# Altium schematic sheet Sheet2-sensor.SchDoc
size A4; SheetNumber: 3; SheetTotal: 4
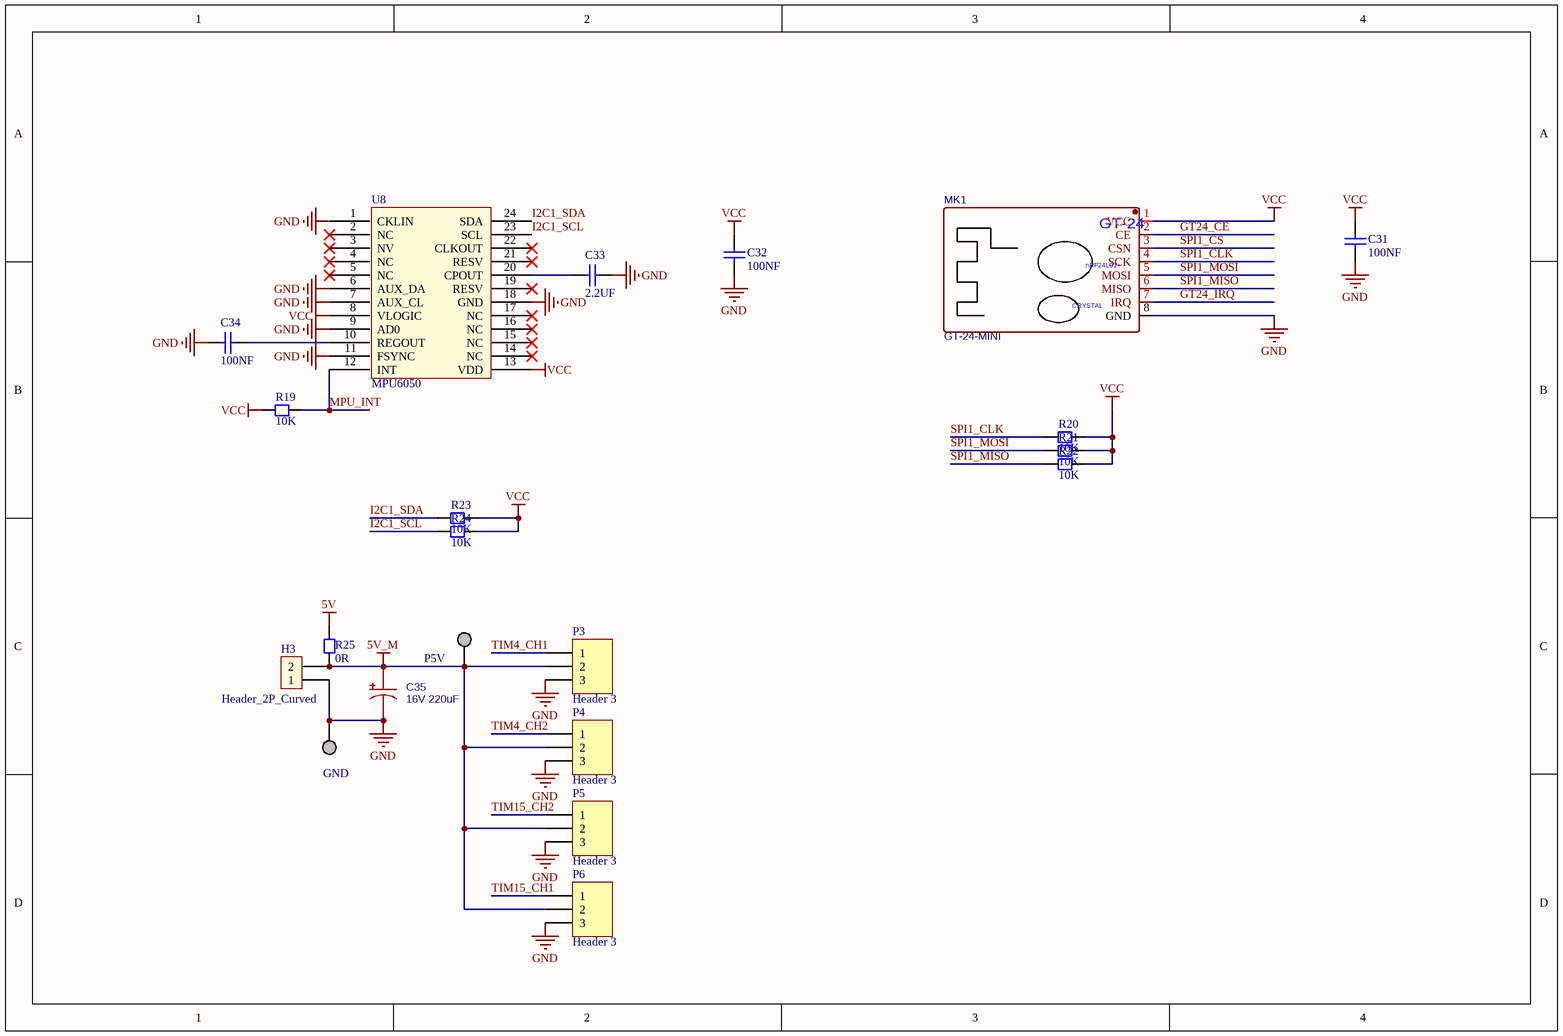
[diagram p0: Sheet2-sensor.SchDoc]

## Parts
C31  100NF  [CC1608-0603]
C32  100NF  [CC1608-0603]
C33  2.2UF  [CC1608-0603]
C34  100NF  [CC1608-0603]
C35  16V 220uF  [CAP-SMD_D6.3]
GND  test  [test]  (value not drawn)
H3  Header_2P_Curved  [Header_2_54_2PW]
MK1  GT-24-MINI  [GT24 _MINI]
P3  Header 3  [HDR1X3]
P4  Header 3  [HDR1X3]
P5  Header 3  [HDR1X3]
P5V  test  [test]  (value not drawn)
P6  Header 3  [HDR1X3]
R19  10K  [CR1608-0603]
R20  10K  [CR1608-0603]
R21  10K  [CR1608-0603]
R22  10K  [CR1608-0603]
R23  10K  [CR1608-0603]
R24  10K  [CR1608-0603]
R25  0R  [CR1608-0603]
U8  MPU6050  [QFN24 - duplicate]

## Nets
5V: R25.1
5V_M: C35.1 H3.2 P3.2 P4.2 P5.2 P5V.0 P6.2 R25.2
GND: C31.2 C32.2 C33.2 C34.1 C35.2 GND.0 H3.1 MK1.8(GND) P3.3 P4.3 P5.3 P6.3 U8.1(CKLIN) U8.6(AUX_DA) U8.7(AUX_CL) U8.9(AD0) U8.11(FSYNC) U8.18(GND)
VCC: C31.1 C32.1 MK1.1(VCC) R19.2 R20.1 R21.1 R22.1 R23.1 R24.1 U8.8(VLOGIC) U8.13(VDD)
GT24_CE: MK1.2(CE)
GT24_IRQ: MK1.7(IRQ)
I2C1_SCL: R24.2 U8.23(SCL)
I2C1_SDA: R23.2 U8.24(SDA)
MPU_INT: R19.1 U8.12(INT)
SPI1_CLK: MK1.4(SCK) R20.2
SPI1_CS: MK1.3(CSN)
SPI1_MISO: MK1.6(MISO) R22.2
SPI1_MOSI: MK1.5(MOSI) R21.2
TIM4_CH1: P3.1
TIM4_CH2: P4.1
TIM15_CH1: P6.1
TIM15_CH2: P5.1
NetC33_1: C33.1 U8.20(CPOUT)
NetC34_2: C34.2 U8.10(REGOUT)

Not connected (* = marked no-connect by the designer): U8 2(NC)* 3(NV)* 4(NC)* 5(NC)* 14(NC)* 15(NC)* 16(NC)* 17(NC)* 19(RESV)* 21(RESV)* 22(CLKOUT)*

## Notes on the sheet
- (in symbol GT-24-MINI) GT-24; nRF24L01+; CRYSTAL

## Library data of the parts
C31-C34 = Chip capacitor: 贴片电容
C35 = Cap ECAP SMD: 铝点解电容; BOM_Manufacturer: PANASONIC; BOM_Manufacturer Part: EEEFP1C681AP; nameAlias: Capacitance; Contributor: LCSC; BOM_Supplier: LCSC; BOM_Supplier Part: C413527; spicePre: C; spiceSymbolName: EEEFP1C681AP
GND P5V = test: 测试点
H3 = Header_2P_Curved: 弯的2P排针
MK1 = GT-24-MINI: 工业级GT-24数传无线模块 2.4G NRF24L01&PA+LNA; Manufacturer: Ashining(泽耀科技); Manufacturer Part: AS01-ML01S; Supplier: LCSC; Supplier Part: C84802; JLCPCB Part Class: Extended Part; spicePre: M; spiceSymbolName: AS01-ML01S
P3-P6 = Header 3: Header, 3-Pin; LatestRevisionDate: 17-Jul-2002; LatestRevisionNote: Re-released for DXP Platform.; Publisher: Altium Limited
R19-R25 = Chip resistor: 贴片电阻
U8 = MPU6050: 陀螺仪